# EAGLE design USBdimmer-control-noxfmr (EAGLE 6.5.0)
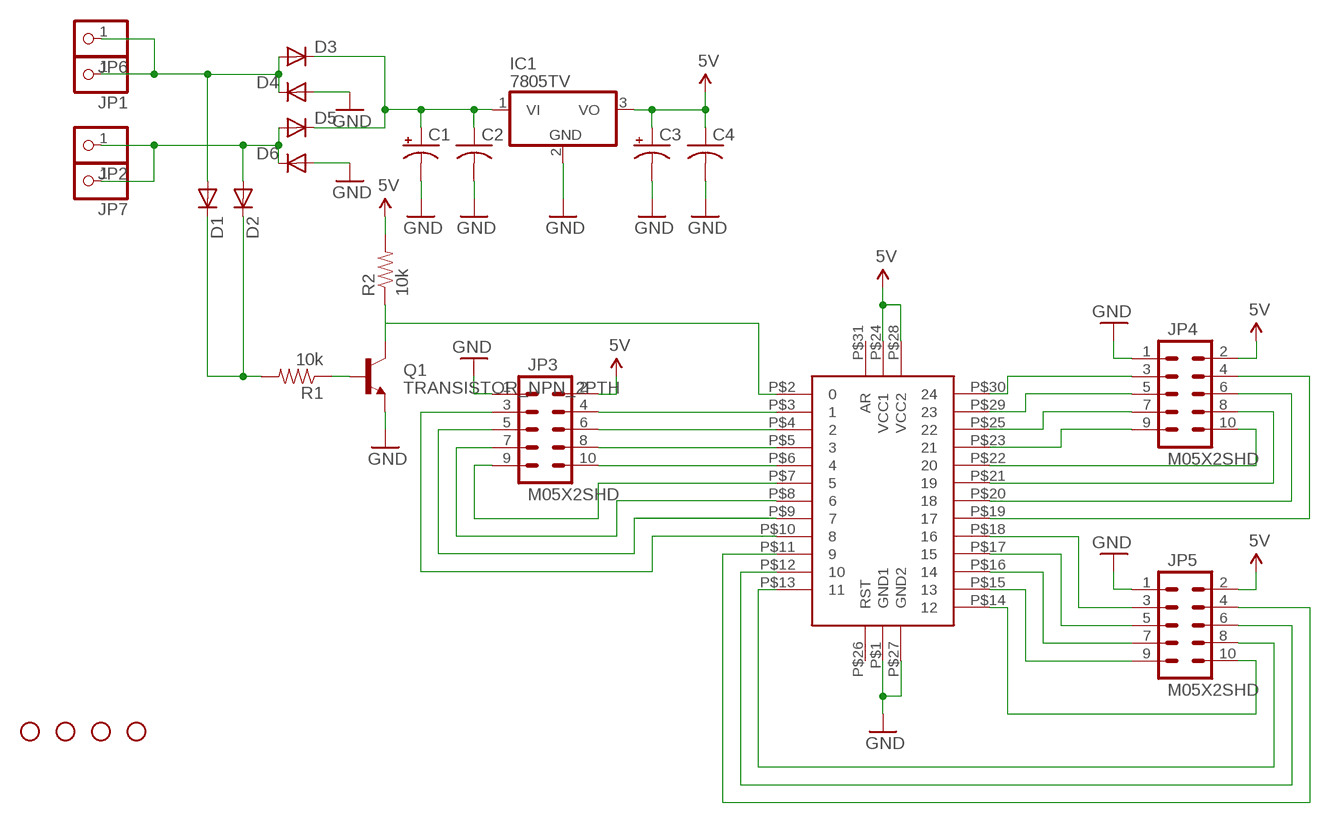
[diagram p0: schematic, sheet 1]

## Parts
C1  CPOL-USE3.5-10  [E3,5-10]
C2  C-US025-030X050  [C025-030X050]
C3  CPOL-USE3.5-10  [E3,5-10]
C4  C-US025-030X050  [C025-030X050]
D1  DIODE1N4148  [DIODE-1N4148]
D2  DIODE1N4148  [DIODE-1N4148]
D3  DIODEPTH  [DIODE-1N4001]
D4  DIODEPTH  [DIODE-1N4001]
D5  DIODEPTH  [DIODE-1N4001]
D6  DIODEPTH  [DIODE-1N4001]
IC1  7805TV  [TO220V]
IC2  TEENSY2  [TEENSY2]
JP1  PINHD-1X1  [1X01]
JP2  PINHD-1X1  [1X01]
JP3  M05X2SHD  [2X5-SHROUDED]
JP4  M05X2SHD  [2X5-SHROUDED]
JP5  M05X2SHD  [2X5-SHROUDED]
JP6  PINHD-1X1  [1X01]
JP7  PINHD-1X1  [1X01]
Q1  TRANSISTOR_NPN_2PTH  [TO-92]
R1  10k  RESISTORPTH-1/4W  [AXIAL-0.4]
R2  10k  RESISTORPTH-1/4W  [AXIAL-0.4]
STANDOFF1  STAND-OFF  [STAND-OFF]
STANDOFF2  STAND-OFF  [STAND-OFF]
STANDOFF3  STAND-OFF  [STAND-OFF]
STANDOFF4  STAND-OFF  [STAND-OFF]

## Nets
5V: C3.+ C4.1 IC1.3(VO) IC2.P$24(VCC1) IC2.P$28(VCC2) JP3.2 JP4.2 JP5.2 R2.P$2
GND: C1.- C2.2 C3.- C4.2 D4.A D6.A IC1.2(GND) IC2.P$1(GND1) IC2.P$27(GND2) JP3.1 JP4.1 JP5.1 Q1.3(E)
N$1: D2.A D5.A D6.C JP2.1 JP7.1
N$2: D1.A D3.A D4.C JP1.1 JP6.1
N$3: C1.+ C2.1 D3.C D5.C IC1.1(VI)
N$4: IC2.P$21 JP4.8
N$5: IC2.P$20 JP4.6
N$6: Q1.2(B) R1.P$1
N$7: D1.C D2.C R1.P$2
N$8: IC2.P$2 Q1.1(C) R2.P$1
N$9: IC2.P$19 JP4.4
N$10: IC2.P$18 JP5.3
N$12: IC2.P$3 JP3.4
N$13: IC2.P$4 JP3.6
N$14: IC2.P$5 JP3.8
N$15: IC2.P$6 JP3.10
N$16: IC2.P$7 JP3.9
N$17: IC2.P$8 JP3.7
N$19: IC2.P$17 JP5.5
N$20: IC2.P$16 JP5.7
N$21: IC2.P$9 JP3.5
N$22: IC2.P$10 JP3.3
N$23: IC2.P$30 JP4.3
N$24: IC2.P$15 JP5.9
N$25: IC2.P$14 JP5.10
N$26: IC2.P$29 JP4.5
N$27: IC2.P$25 JP4.7
N$28: IC2.P$23 JP4.9
N$29: IC2.P$22 JP4.10
N$30: IC2.P$13 JP5.8
N$31: IC2.P$12 JP5.6
N$32: IC2.P$11 JP5.4
Unconnected: IC2.P$26(RST) IC2.P$31(AR)

## Library data of the parts
C1 C3 = adafruit:CPOL-US: POLARIZED CAPACITOR, American symbol
C2 C4 = adafruit:C-US: CAPACITOR, American symbol
D1-D6 = SparkFun-DiscreteSemi:DIODE: Diode These are standard reverse protection diodes and small signal diodes. SMA package can handle up to about 1A. SOD-323 can handle about 200mA. What the SOD-323 package when ordering, there are some mfgs out there that are 5-pin packages.
IC1 = linear:78*: Positive VOLTAGE REGULATOR Source: http://cache.national.com/ds/LM/LM78L05.pdf http://www.fairchildsemi.com/ds/LM/LM7805.pdf
IC2 = bodger:TEENSY2
JP1 JP2 JP6 JP7 = adafruit:PINHD-1X1: Pin header 1x1 for 0.1" spacing With round pins
JP3-JP5 = SparkFun-Connectors:M05X2: Header 5x2 Standard 10-pin dual row 0.1" header. Commonly used with AVR-ISP. Use with Spark Fun Electronics SKU: PRT-00778
Q1 = SparkFun-DiscreteSemi:TRANSISTOR_NPN_2: Alternate TO-92 NPN BJT
R1 R2 = SparkFun-Passives:RESISTOR: Resistor Basic schematic elements and footprints for 0603, 1206, and PTH resistors.
STANDOFF1-STANDOFF4 = SparkFun-Electromechanical:STAND-OFF: #4 Stand Off This is the mechanical footprint for a #4 phillips button head screw. Use the keepout ring to avoid running the screw head into surrounding components. SKU : PRT-00447

## Board
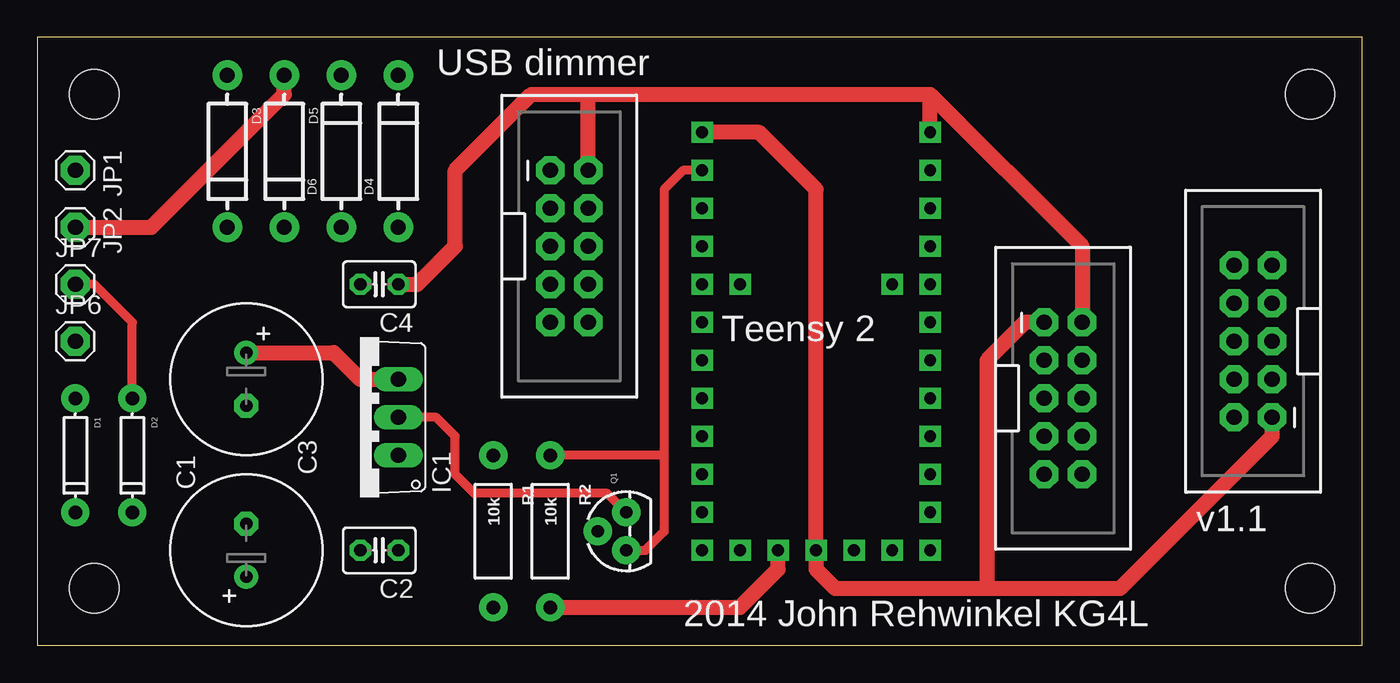
[diagram p1: board, top side]
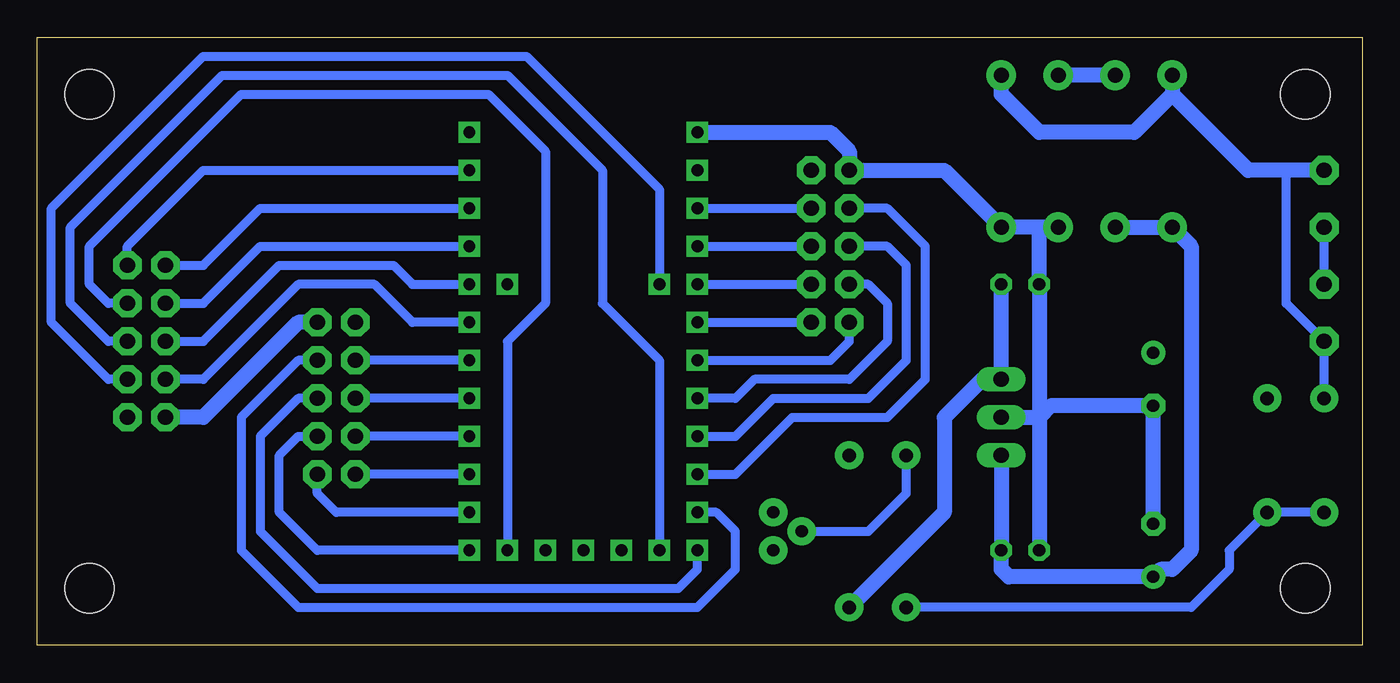
[diagram p2: board, bottom side, seen from below]

Size 88.57 x 40.63 mm. Coordinates in mm from the lower left corner, seen from the top.
Outline: 0,0 88.57,0 88.57,40.63 0,40.63 0,0
Copper layers (1*16): Top 0.035mm / dielectric 1.5mm / Bottom 0.035mm
Design rules "SparkFun": minimum track width 8mil, minimum drill 20mil, track to track 8mil, track to pad 8mil, pad to pad 8mil, via to via 8mil, smd to smd 8mil, copper to edge 10mil, drill to drill 8mil, minimum pad ring 12mil, minimum via ring 10mil, stop-mask expansion 4mil, vias tented up to drill 25mil, thermal gap 10mil

### Footprints (pad centres in the part's own frame; a part is rotated, then mirrored left to right if it is on the bottom)
E3,5-10 = drill 0.813 pad 1.6: + -1.778,0 | drill 0.813 pad 1.6 octagon: - 1.778,0
C025-030X050 = drill 0.813 pad 1.422 octagon: 1 -1.27,0; 2 1.27,0
DIODE-1N4148 = drill 0.9 pad 1.88: A -3.81,0; C 3.81,0
DIODE-1N4001 = drill 1 pad 1.981: A -5.08,0; C 5.08,0
TO220V = drill 1.016 long: 1 -2.54,-2.54; 2 0,-2.54; 3 2.54,-2.54
TEENSY2 = drill 0.8 square: P$1 -7.62,15.24; P$2 -7.62,12.7; P$3 -7.62,10.16; P$4 -7.62,7.62; P$5 -7.62,5.08; P$6 -7.62,2.54; P$7 -7.62,0; P$8 -7.62,-2.54; P$9 -7.62,-5.08; P$10 -7.62,-7.62; P$11 -7.62,-10.16; P$12 -7.62,-12.7; P$13 7.62,-12.7; P$14 7.62,-10.16; P$15 7.62,-7.62; P$16 7.62,-5.08; P$17 7.62,-2.54; P$18 7.62,0; P$19 7.62,2.54; P$20 7.62,5.08; P$21 7.62,7.62; P$22 7.62,10.16; P$23 7.62,12.7; P$24 7.62,15.24; P$25 5.08,-12.7; P$26 2.54,-12.7; P$27 0,-12.7; P$28 -2.54,-12.7; P$29 -5.08,-12.7; P$30 -5.08,5.08; P$31 5.08,5.08
1X01 = drill 1.016 pad 1.93 octagon: 1 0,0
2X5-SHROUDED = drill 1.016 pad 1.88 octagon: 1 -1.27,5.08; 2 1.27,5.08; 3 -1.27,2.54; 4 1.27,2.54; 5 -1.27,0; 6 1.27,0; 7 -1.27,-2.54; 8 1.27,-2.54; 9 -1.27,-5.08; 10 1.27,-5.08
TO-92 = drill 0.813 pad 1.88: 1 -1.27,0; 2 0,1.905; 3 1.27,0
AXIAL-0.4 = drill 0.9 pad 1.88: P$1 -5.08,0; P$2 5.08,0
STAND-OFF = hole 3.302: 0,0

### Placement (x,y rotation side)
C1  13.97,6.35 90 top
C2  22.86,6.35 180 top
C3  13.97,17.78 270 top
C4  22.86,24.13 180 top
D1  2.54,12.7 270 top
D2  6.35,12.7 270 top
D3  12.7,33.02 270 top
D4  24.13,33.02 90 top
D5  16.51,33.02 270 top
D6  20.32,33.02 90 top
IC1  21.59,15.24 90 top
IC2  52.07,19.05 0 top
JP1  2.54,31.75 270 top
JP2  2.54,27.94 270 top
JP3  35.56,26.67 0 top
JP4  81.28,20.32 180 top
JP5  68.58,16.51 0 top
JP6  2.54,20.32 0 top
JP7  2.54,24.13 0 top
Q1  39.37,7.62 90 top
R1  30.48,7.62 270 top
R2  34.29,7.62 270 top
STANDOFF1  3.81,3.81 0 top
STANDOFF2  3.81,36.83 0 top
STANDOFF3  85.09,36.83 0 top
STANDOFF4  85.09,3.81 352.2 top

### Tracks (layer width: path | path; a pad name or v marks a point on that pad's centre or on a via)
5V
  Top 1.016: C3.+ 19.81,19.56 21.59,17.78 IC1.3 | R2.P$2 46.99,2.54 49.53,5.08 IC2.P$28 | C4.1 25.4,24.13 27.94,26.67 27.94,31.75 33.02,36.83 36.83,36.83 | JP5.2 69.85,26.67 59.69,36.83 | JP3.2 36.83,36.83 | 36.83,36.83 59.69,36.83 | IC2.P$24 59.69,36.83
  Bottom 1.016: C4.1 IC1.3 25.4,17.78 27.94,15.24 27.94,8.89 R2.P$2 | JP5.2 71.12,21.59 77.47,15.24 JP4.2
GND
  Top 0.61: Q1.3 38.1,10.16 29.21,10.16 27.94,11.43 27.94,13.97 26.67,15.24 IC1.2
  Top 1.016: 63.5,3.81 53.34,3.81 52.07,5.08 IC2.P$27 52.07,30.48 48.26,34.29 IC2.P$1 | 63.5,3.81 72.39,3.81 82.55,13.97 JP4.1 | JP5.1 66.04,21.59 63.5,19.05 63.5,3.81
  Bottom 1.016: D6.A 21.59,27.94 | 21.59,27.94 D4.A 27.94,31.75 JP3.1 34.29,33.02 35.56,34.29 IC2.P$1 | 21.59,27.94 C4.2 21.59,15.24 | C1.- C3.- 20.83,16 21.59,15.24 | 21.59,15.24 C2.2 | IC1.2 21.59,15.24
N$1
  Top 0.61: D2.A 6.35,21.59 3.81,24.13 JP7.1
  Top 1.016: JP2.1 7.62,27.94 16.51,36.83 D5.A
  Bottom 0.61: JP7.1 JP2.1
  Bottom 1.016: D5.A D6.C
N$2
  Bottom 0.61: D1.A JP6.1 5.08,22.86 5.08,31.75
  Bottom 1.016: D3.A 12.7,36.83 | 12.7,36.83 15.24,34.29 21.59,34.29 24.13,36.83 D4.C | JP1.1 5.08,31.75 7.62,31.75 12.7,36.83
N$3
  Bottom 1.016: IC1.1 C2.1 24.13,5.08 23.62,4.57 C1.+ 13.46,5.08 12.7,5.08 11.43,6.35 11.43,26.67 D3.C D5.C
N$4
  Bottom 0.61: JP4.8 77.47,22.86 73.66,26.67 IC2.P$21
N$5
  Bottom 0.61: JP4.6 77.47,20.32 72.39,25.4 64.77,25.4 63.5,24.13 IC2.P$20
N$6
  Bottom 0.61: Q1.2 33.02,7.62 30.48,10.16 R1.P$1
N$7
  Bottom 0.61: D1.C D2.C 8.89,6.35 8.89,5.08 11.43,2.54 R1.P$2
N$8
  Top 0.61: IC2.P$2 43.18,31.75 41.91,30.48 41.91,12.7 | 41.91,12.7 41.91,7.62 40.64,6.35 Q1.1 | 41.91,12.7 R2.P$1
N$9
  Bottom 0.61: IC2.P$19 63.5,21.59 66.04,24.13 71.12,24.13 77.47,17.78 JP4.4
N$10
  Bottom 0.61: IC2.P$18 JP5.3
N$12
  Bottom 0.61: IC2.P$3 JP3.4
N$13
  Bottom 0.61: IC2.P$4 JP3.6
N$14
  Bottom 0.61: IC2.P$5 JP3.8
N$15
  Bottom 0.61: IC2.P$6 JP3.10
N$16
  Bottom 0.61: IC2.P$7 35.56,19.05 34.29,20.32 JP3.9
N$17
  Bottom 0.61: JP3.7 33.02,24.13 31.75,22.86 31.75,20.32 34.29,17.78 40.64,17.78 41.91,16.51 IC2.P$8
N$19
  Bottom 0.61: IC2.P$17 JP5.5
N$20
  Bottom 0.61: IC2.P$16 JP5.7
N$21
  Bottom 0.61: IC2.P$9 41.91,13.97 39.37,16.51 33.02,16.51 30.48,19.05 30.48,25.4 31.75,26.67 JP3.5
N$22
  Bottom 0.61: IC2.P$10 41.91,11.43 38.1,15.24 31.75,15.24 29.21,17.78 29.21,26.67 31.75,29.21 JP3.3
N$23
  Bottom 0.61: JP4.3 83.82,17.78 87.63,21.59 87.63,29.21 77.47,39.37 55.88,39.37 46.99,30.48 IC2.P$30
N$24
  Bottom 0.61: IC2.P$15 JP5.9
N$25
  Bottom 0.61: IC2.P$14 68.58,8.89 69.85,10.16 JP5.10
N$26
  Bottom 0.61: JP4.5 83.82,20.32 86.36,22.86 86.36,27.94 76.2,38.1 57.15,38.1 50.8,31.75 50.8,22.86 46.99,19.05 IC2.P$29
N$27
  Bottom 0.61: JP4.7 83.82,22.86 85.09,24.13 85.09,26.67 74.93,36.83 58.42,36.83 54.61,33.02 54.61,22.86 57.15,20.32 IC2.P$25
N$28
  Bottom 0.61: JP4.9 82.55,26.67 77.47,31.75 IC2.P$23
N$29
  Bottom 0.61: JP4.10 77.47,25.4 73.66,29.21 IC2.P$22
N$30
  Bottom 0.61: IC2.P$13 69.85,6.35 72.39,8.89 72.39,12.7 71.12,13.97 JP5.8
N$31
  Bottom 0.61: JP5.6 71.12,16.51 73.66,13.97 73.66,7.62 69.85,3.81 45.72,3.81 44.45,5.08 IC2.P$12
N$32
  Bottom 0.61: JP5.4 71.12,19.05 74.93,15.24 74.93,6.35 71.12,2.54 44.45,2.54 41.91,5.08 41.91,7.62 43.18,8.89 IC2.P$11

### Text on the board
tPlace: USB dimmer | Teensy 2 | v1.1 | 2014 John Rehwinkel KG4L